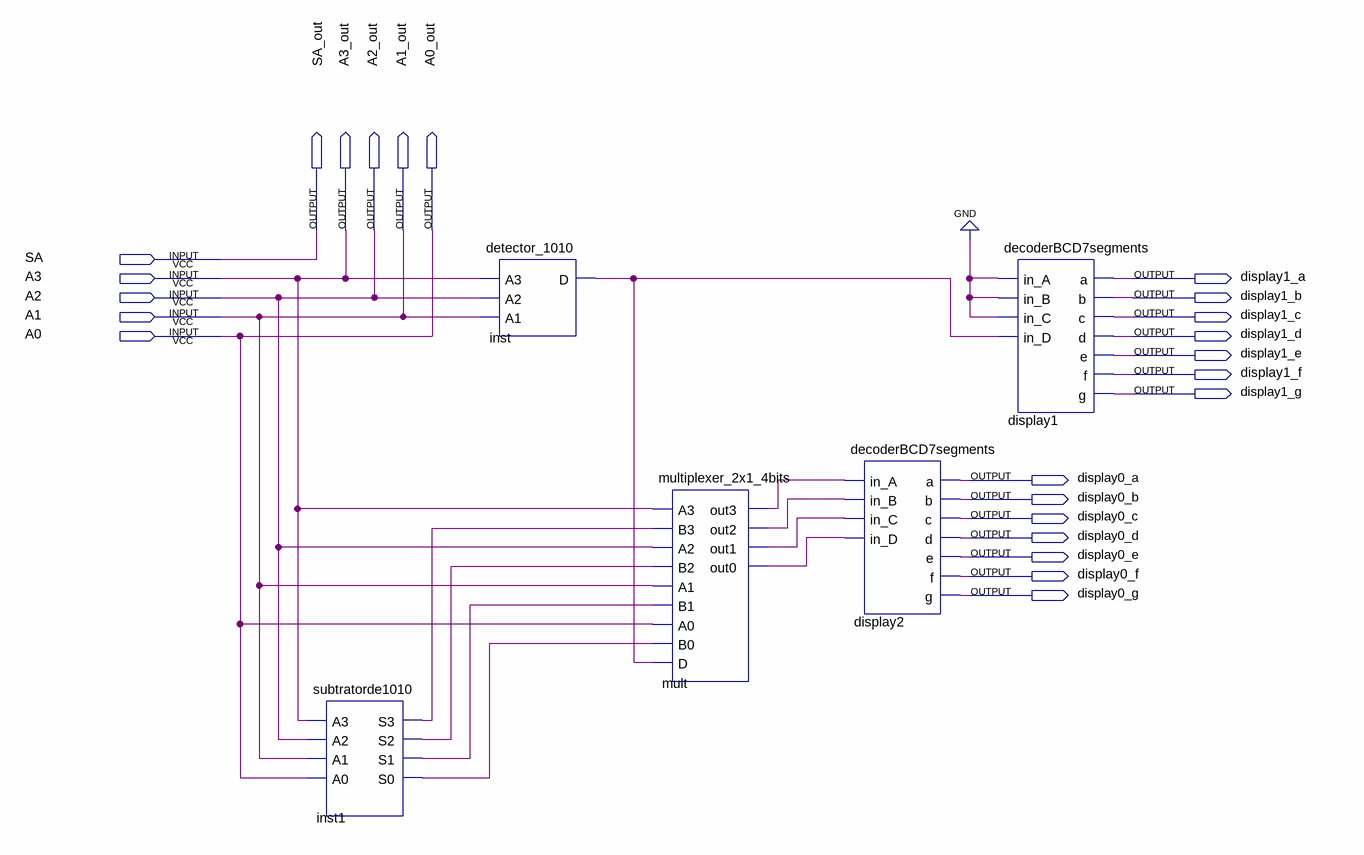
[diagram p0: schematic sheet]
// Quartus schematic displayLedsEntradaSaida.bdf as structural Verilog: 5 symbols, 24 pins
module displayLedsEntradaSaida (
  input  SA,
  input  A3,
  input  A2,
  input  A1,
  input  A0,
  output SA_out,
  output A3_out,
  output A2_out,
  output A1_out,
  output A0_out,
  output display1_a,
  output display1_b,
  output display1_c,
  output display1_d,
  output display1_e,
  output display1_f,
  output display1_g,
  output display0_a,
  output display0_b,
  output display0_c,
  output display0_d,
  output display0_e,
  output display0_f,
  output display0_g
);

  wire inst1_s0, inst1_s1, inst1_s2, inst1_s3, inst_d, mult_out0, mult_out1, mult_out2, mult_out3;

  subtratorde1010 inst1 (
    .A3(A3), .A2(A2), .A1(A1), .A0(A0), .S3(inst1_s3), .S2(inst1_s2), .S1(inst1_s1), .S0(inst1_s0));
  detector_1010 inst (.A3(A3), .A2(A2), .A1(A1), .D(inst_d));
  multiplexer_2x1_4bits mult (
    .A3(A3), .B3(inst1_s3), .A2(A2), .B2(inst1_s2), .A1(A1), .B1(inst1_s1), .A0(A0), .B0(inst1_s0),
    .D(inst_d), .out3(mult_out3), .out2(mult_out2), .out1(mult_out1), .out0(mult_out0));
  decoderBCD7segments display2 (
    .in_A(mult_out3), .in_B(mult_out2), .in_C(mult_out1), .in_D(mult_out0), .a(display0_a), .b(display0_b),
    .c(display0_c), .d(display0_d), .e(display0_e), .f(display0_f), .g(display0_g));
  decoderBCD7segments display1 (
    .in_A(1'b0), .in_B(1'b0), .in_C(1'b0), .in_D(inst_d), .a(display1_a), .b(display1_b), .c(display1_c),
    .d(display1_d), .e(display1_e), .f(display1_f), .g(display1_g));

  assign A0_out = A0;
  assign A1_out = A1;
  assign A2_out = A2;
  assign A3_out = A3;
  assign SA_out = SA;
endmodule
